# EasyEDA Pro project ProPrj_电容计量V2_2026-06-24.epro, schematic Schematic18
Board Name: Board2; Create Date: 2026-04-20; Page Name: P1; Project Name: 电容计量V2; Schematic Name: Schematic18; Update Date: 2026-04-20; Page Size: A4; Version: V1.0
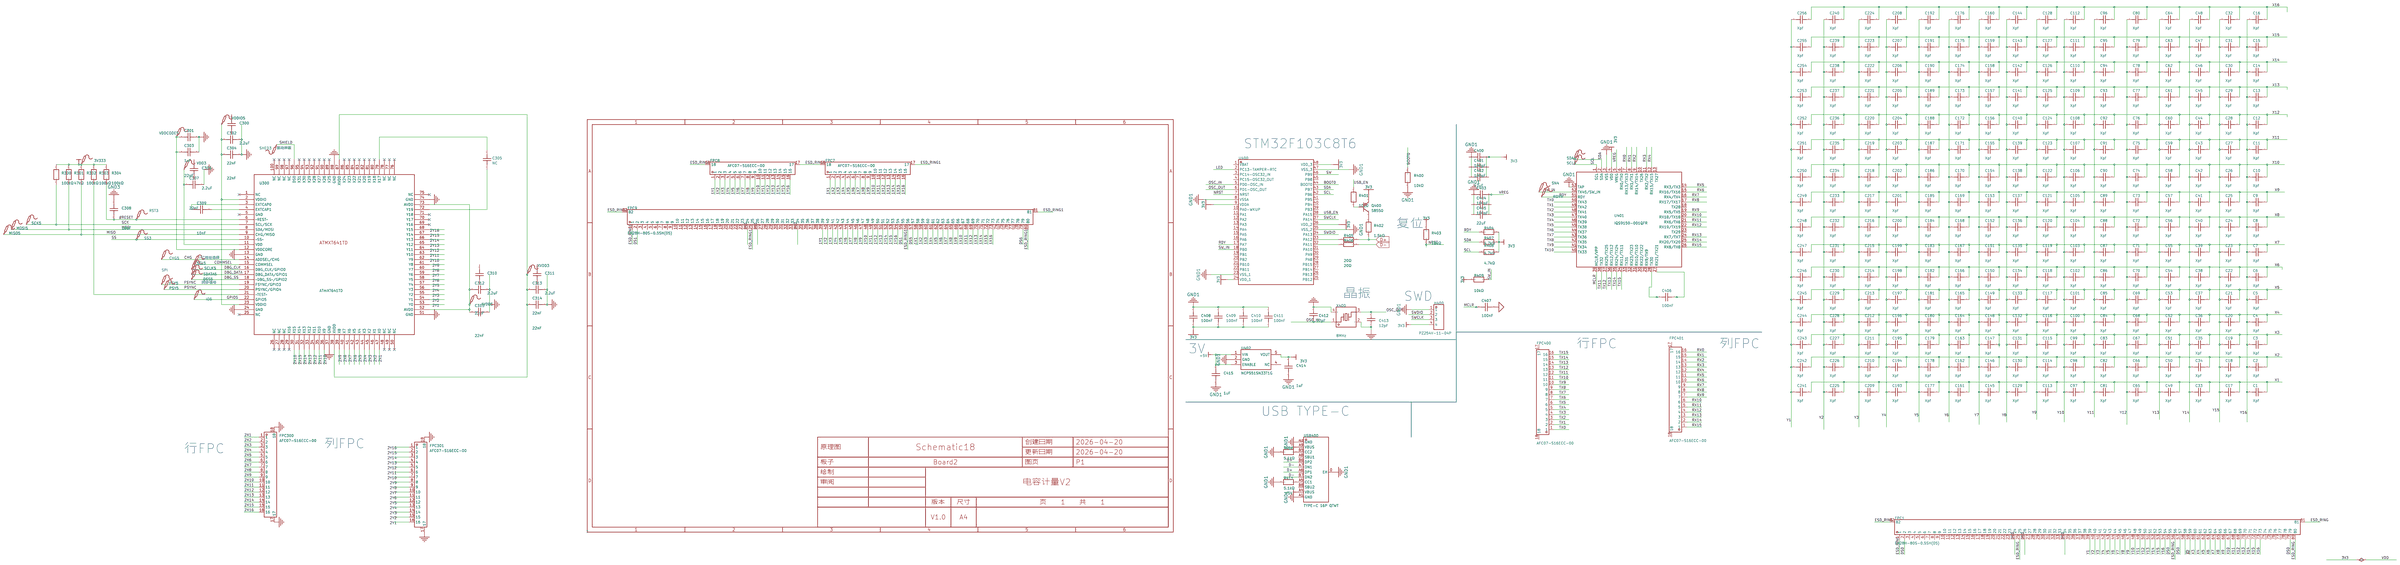
[diagram p1: schematic sheet]

## Parts
3V333  -  [Test-Point-0.5mm]
AVDD5  -  [Test-Point-0.5mm]
C1  Xpf  [CAP_C_0603]
C2  Xpf  [CAP_C_0603]
C3  Xpf  [CAP_C_0603]
C4  Xpf  [CAP_C_0603]
C5  Xpf  [CAP_C_0603]
C6  Xpf  [CAP_C_0603]
C7  Xpf  [CAP_C_0603]
C8  Xpf  [CAP_C_0603]
C9  Xpf  [CAP_C_0603]
C10  Xpf  [CAP_C_0603]
C11  Xpf  [CAP_C_0603]
C12  Xpf  [CAP_C_0603]
C13  Xpf  [CAP_C_0603]
C14  Xpf  [CAP_C_0603]
C15  Xpf  [CAP_C_0603]
C16  Xpf  [CAP_C_0603]
C17  Xpf  [CAP_C_0603]
C18  Xpf  [CAP_C_0603]
C19  Xpf  [CAP_C_0603]
C20  Xpf  [CAP_C_0603]
C21  Xpf  [CAP_C_0603]
C22  Xpf  [CAP_C_0603]
C23  Xpf  [CAP_C_0603]
C24  Xpf  [CAP_C_0603]
C25  Xpf  [CAP_C_0603]
C26  Xpf  [CAP_C_0603]
C27  Xpf  [CAP_C_0603]
C28  Xpf  [CAP_C_0603]
C29  Xpf  [CAP_C_0603]
C30  Xpf  [CAP_C_0603]
C31  Xpf  [CAP_C_0603]
C32  Xpf  [CAP_C_0603]
C33  Xpf  [CAP_C_0603]
C34  Xpf  [CAP_C_0603]
C35  Xpf  [CAP_C_0603]
C36  Xpf  [CAP_C_0603]
C37  Xpf  [CAP_C_0603]
C38  Xpf  [CAP_C_0603]
C39  Xpf  [CAP_C_0603]
C40  Xpf  [CAP_C_0603]
C41  Xpf  [CAP_C_0603]
C42  Xpf  [CAP_C_0603]
C43  Xpf  [CAP_C_0603]
C44  Xpf  [CAP_C_0603]
C45  Xpf  [CAP_C_0603]
C46  Xpf  [CAP_C_0603]
C47  Xpf  [CAP_C_0603]
C48  Xpf  [CAP_C_0603]
C49  Xpf  [CAP_C_0603]
C50  Xpf  [CAP_C_0603]
C51  Xpf  [CAP_C_0603]
C52  Xpf  [CAP_C_0603]
C53  Xpf  [CAP_C_0603]
C54  Xpf  [CAP_C_0603]
C55  Xpf  [CAP_C_0603]
C56  Xpf  [CAP_C_0603]
C57  Xpf  [CAP_C_0603]
C58  Xpf  [CAP_C_0603]
C59  Xpf  [CAP_C_0603]
C60  Xpf  [CAP_C_0603]
C61  Xpf  [CAP_C_0603]
C62  Xpf  [CAP_C_0603]
C63  Xpf  [CAP_C_0603]
C64  Xpf  [CAP_C_0603]
C65  Xpf  [CAP_C_0603]
C66  Xpf  [CAP_C_0603]
C67  Xpf  [CAP_C_0603]
C68  Xpf  [CAP_C_0603]
C69  Xpf  [CAP_C_0603]
C70  Xpf  [CAP_C_0603]
C71  Xpf  [CAP_C_0603]
C72  Xpf  [CAP_C_0603]
C73  Xpf  [CAP_C_0603]
C74  Xpf  [CAP_C_0603]
C75  Xpf  [CAP_C_0603]
C76  Xpf  [CAP_C_0603]
C77  Xpf  [CAP_C_0603]
C78  Xpf  [CAP_C_0603]
C79  Xpf  [CAP_C_0603]
C80  Xpf  [CAP_C_0603]
C81  Xpf  [CAP_C_0603]
C82  Xpf  [CAP_C_0603]
C83  Xpf  [CAP_C_0603]
C84  Xpf  [CAP_C_0603]
C85  Xpf  [CAP_C_0603]
C86  Xpf  [CAP_C_0603]
C87  Xpf  [CAP_C_0603]
C88  Xpf  [CAP_C_0603]
C89  Xpf  [CAP_C_0603]
C90  Xpf  [CAP_C_0603]
C91  Xpf  [CAP_C_0603]
C92  Xpf  [CAP_C_0603]
C93  Xpf  [CAP_C_0603]
C94  Xpf  [CAP_C_0603]
C95  Xpf  [CAP_C_0603]
C96  Xpf  [CAP_C_0603]
C97  Xpf  [CAP_C_0603]
C98  Xpf  [CAP_C_0603]
C99  Xpf  [CAP_C_0603]
C100  Xpf  [CAP_C_0603]
C101  Xpf  [CAP_C_0603]
C102  Xpf  [CAP_C_0603]
C103  Xpf  [CAP_C_0603]
C104  Xpf  [CAP_C_0603]
C105  Xpf  [CAP_C_0603]
C106  Xpf  [CAP_C_0603]
C107  Xpf  [CAP_C_0603]
C108  Xpf  [CAP_C_0603]
C109  Xpf  [CAP_C_0603]
C110  Xpf  [CAP_C_0603]
C111  Xpf  [CAP_C_0603]
C112  Xpf  [CAP_C_0603]
C113  Xpf  [CAP_C_0603]
C114  Xpf  [CAP_C_0603]
C115  Xpf  [CAP_C_0603]
C116  Xpf  [CAP_C_0603]
C117  Xpf  [CAP_C_0603]
C118  Xpf  [CAP_C_0603]
C119  Xpf  [CAP_C_0603]
C120  Xpf  [CAP_C_0603]
C121  Xpf  [CAP_C_0603]
C122  Xpf  [CAP_C_0603]
C123  Xpf  [CAP_C_0603]
C124  Xpf  [CAP_C_0603]
C125  Xpf  [CAP_C_0603]
C126  Xpf  [CAP_C_0603]
C127  Xpf  [CAP_C_0603]
C128  Xpf  [CAP_C_0603]
C129  Xpf  [CAP_C_0603]
C130  Xpf  [CAP_C_0603]
C131  Xpf  [CAP_C_0603]
C132  Xpf  [CAP_C_0603]
C133  Xpf  [CAP_C_0603]
C134  Xpf  [CAP_C_0603]
C135  Xpf  [CAP_C_0603]
C136  Xpf  [CAP_C_0603]
C137  Xpf  [CAP_C_0603]
C138  Xpf  [CAP_C_0603]
C139  Xpf  [CAP_C_0603]
C140  Xpf  [CAP_C_0603]
C141  Xpf  [CAP_C_0603]
C142  Xpf  [CAP_C_0603]
C143  Xpf  [CAP_C_0603]
C144  Xpf  [CAP_C_0603]
C145  Xpf  [CAP_C_0603]
C146  Xpf  [CAP_C_0603]
C147  Xpf  [CAP_C_0603]
C148  Xpf  [CAP_C_0603]
C149  Xpf  [CAP_C_0603]
C150  Xpf  [CAP_C_0603]
C151  Xpf  [CAP_C_0603]
C152  Xpf  [CAP_C_0603]
C153  Xpf  [CAP_C_0603]
C154  Xpf  [CAP_C_0603]
C155  Xpf  [CAP_C_0603]
C156  Xpf  [CAP_C_0603]
C157  Xpf  [CAP_C_0603]
C158  Xpf  [CAP_C_0603]
C159  Xpf  [CAP_C_0603]
C160  Xpf  [CAP_C_0603]
C161  Xpf  [CAP_C_0603]
C162  Xpf  [CAP_C_0603]
C163  Xpf  [CAP_C_0603]
C164  Xpf  [CAP_C_0603]
C165  Xpf  [CAP_C_0603]
C166  Xpf  [CAP_C_0603]
C167  Xpf  [CAP_C_0603]
C168  Xpf  [CAP_C_0603]
C169  Xpf  [CAP_C_0603]
C170  Xpf  [CAP_C_0603]
C171  Xpf  [CAP_C_0603]
C172  Xpf  [CAP_C_0603]
C173  Xpf  [CAP_C_0603]
C174  Xpf  [CAP_C_0603]
C175  Xpf  [CAP_C_0603]
C176  Xpf  [CAP_C_0603]
C177  Xpf  [CAP_C_0603]
C178  Xpf  [CAP_C_0603]
C179  Xpf  [CAP_C_0603]
C180  Xpf  [CAP_C_0603]
C181  Xpf  [CAP_C_0603]
C182  Xpf  [CAP_C_0603]
C183  Xpf  [CAP_C_0603]
C184  Xpf  [CAP_C_0603]
C185  Xpf  [CAP_C_0603]
C186  Xpf  [CAP_C_0603]
C187  Xpf  [CAP_C_0603]
C188  Xpf  [CAP_C_0603]
C189  Xpf  [CAP_C_0603]
C190  Xpf  [CAP_C_0603]
C191  Xpf  [CAP_C_0603]
C192  Xpf  [CAP_C_0603]
C193  Xpf  [CAP_C_0603]
C194  Xpf  [CAP_C_0603]
C195  Xpf  [CAP_C_0603]
C196  Xpf  [CAP_C_0603]
C197  Xpf  [CAP_C_0603]
C198  Xpf  [CAP_C_0603]
C199  Xpf  [CAP_C_0603]
C200  Xpf  [CAP_C_0603]
C201  Xpf  [CAP_C_0603]
C202  Xpf  [CAP_C_0603]
C203  Xpf  [CAP_C_0603]
C204  Xpf  [CAP_C_0603]
C205  Xpf  [CAP_C_0603]
C206  Xpf  [CAP_C_0603]
C207  Xpf  [CAP_C_0603]
C208  Xpf  [CAP_C_0603]
C209  Xpf  [CAP_C_0603]
C210  Xpf  [CAP_C_0603]
C211  Xpf  [CAP_C_0603]
C212  Xpf  [CAP_C_0603]
C213  Xpf  [CAP_C_0603]
C214  Xpf  [CAP_C_0603]
C215  Xpf  [CAP_C_0603]
C216  Xpf  [CAP_C_0603]
C217  Xpf  [CAP_C_0603]
C218  Xpf  [CAP_C_0603]
C219  Xpf  [CAP_C_0603]
C220  Xpf  [CAP_C_0603]
C221  Xpf  [CAP_C_0603]
C222  Xpf  [CAP_C_0603]
C223  Xpf  [CAP_C_0603]
C224  Xpf  [CAP_C_0603]
C225  Xpf  [CAP_C_0603]
C226  Xpf  [CAP_C_0603]
C227  Xpf  [CAP_C_0603]
C228  Xpf  [CAP_C_0603]
C229  Xpf  [CAP_C_0603]
C230  Xpf  [CAP_C_0603]
C231  Xpf  [CAP_C_0603]
C232  Xpf  [CAP_C_0603]
C233  Xpf  [CAP_C_0603]
C234  Xpf  [CAP_C_0603]
C235  Xpf  [CAP_C_0603]
C236  Xpf  [CAP_C_0603]
C237  Xpf  [CAP_C_0603]
C238  Xpf  [CAP_C_0603]
C239  Xpf  [CAP_C_0603]
C240  Xpf  [CAP_C_0603]
C241  Xpf  [CAP_C_0603]
C242  Xpf  [CAP_C_0603]
C243  Xpf  [CAP_C_0603]
C244  Xpf  [CAP_C_0603]
C245  Xpf  [CAP_C_0603]
C246  Xpf  [CAP_C_0603]
C247  Xpf  [CAP_C_0603]
C248  Xpf  [CAP_C_0603]
C249  Xpf  [CAP_C_0603]
C250  Xpf  [CAP_C_0603]
C251  Xpf  [CAP_C_0603]
C252  Xpf  [CAP_C_0603]
C253  Xpf  [CAP_C_0603]
C254  Xpf  [CAP_C_0603]
C255  Xpf  [CAP_C_0603]
C256  Xpf  [CAP_C_0603]
C300  2.2uF  [C0402]
C301  1uF  [C0402]
C302  22nF  [C0402]
C303  22nF  [C0402]
C304  22nF  [C0402]
C305  NC  [C0402]
C306  2.2uF  [C0402]
C307  22nF  [C0402]
C308  10nF  [C0402]
C309  10nF  [C0402]
C310  2.2uF  [C0402]
C311  2.2uF  [C0402]
C312  22nF  [C0402]
C313  22nF  [C0402]
C314  22nF  [C0402]
C315  22nF  [C0402]
C400  100pF  [C0402]
C401  100nF  [C0402]
C402  47uF  [C0603]
C403  100pF  [C0402]
C404  100nF  [C0402]
C405  22uF  [C0402]
C406  100nF  [C0402]
C407  100nF  [C0402]
C408  100nF  [C0402]
C409  100nF  [C0402]
C410  100nF  [C0402]
C411  100nF  [C0402]
C412  12pF  [C0402]
C413  12pF  [C0402]
C414  1uF  [C0402]
C415  1uF  [C0402]
CHG5  -  [Test-Point-0.5mm]
DSS5  -  [Test-Point-0.5mm]
FPC1  FH28H-80S-0.5SH(05)  [FFC-SMD_80P-P0.50_FH28H-80S-0.5SH]
FPC7  AFC07-S16ECC-00  [FPC-SMD_16P-P0.50_AFC07-S16ECC-00]
FPC8  AFC07-S16ECC-00  [FPC-SMD_16P-P0.50_AFC07-S16ECC-00]
FPC9  FH28H-80S-0.5SH(05)  [FFC-SMD_80P-P0.50_FH28H-80S-0.5SH]
FPC300  AFC07-S16ECC-00  [FPC-SMD_16P-P0.50_AFC07-S16ECC-00]
FPC301  AFC07-S16ECC-00  [FPC-SMD_16P-P0.50_AFC07-S16ECC-00]
FPC400  AFC07-S16ECC-00  [FPC-SMD_16P-P0.50_AFC07-S16ECC-00]
FPC401  AFC07-S16ECC-00  [FPC-SMD_16P-P0.50_AFC07-S16ECC-00]
FSY5  -  [Test-Point-0.5mm]
H400  PZ254V-11-04P  [HDR-TH_4P-P2.54-V-M]
IO5  -  [Test-Point-0.5mm]
MISO5  -  [Test-Point-0.5mm]
MOSI5  -  [Test-Point-0.5mm]
PSY5  -  [Test-Point-0.5mm]
Q400  S8550  [SOT-23-3_L2.9-W1.3-P1.90-LS2.4-BR]
R300  100kΩ  [R0402]
R301  47kΩ  [R0402]
R302  100kΩ  [R0402]
R303  100kΩ  [R0402]
R304  100kΩ  [R0402]
R400  10kΩ  [R0402]
R401  10kΩ  [R0402]
R402  1.5kΩ  [R0402]
R403  10kΩ  [R0402]
R404  4.7kΩ  [R0402]
R405  20Ω  [R0402]
R406  20Ω  [R0402]
R407  4.7kΩ  [R0402]
R408  4.7kΩ  [R0402]
R409  10kΩ  [R0402]
R410  5.1kΩ  [R0402]
R411  5.1kΩ  [R0402]
RDY4  -  [Test-Point-0.5mm]
RST3  -  [Test-Point-0.5mm]
SCK5  -  [Test-Point-0.5mm]
SCL4  -  [Test-Point-0.5mm]
SCLK5  -  [Test-Point-0.5mm]
SDA4  -  [Test-Point-0.5mm]
SDATA5  -  [Test-Point-0.5mm]
SEL5  -  [Test-Point-0.5mm]
SHED3  -  [Test-Point-0.5mm]
SN4  -  [Test-Point-0.5mm]
SS3  -  [Test-Point-0.5mm]
U300  ATmXT641TD  [ATMXT641TD]
U400  -  [LQFP-48_L7.0-W7.0-P0.50-LS9.0-BL]
U401  IQS9150-001QFR  [QFN1-52_L6.0-W6.0-P0.40-TL-EP4.5]
U402  NCP551SN33T1G  [SOT-23-5_L3.0-W1.7-P0.95-LS2.8-BR]
USB400  TYPE-C 16P QTWT  [USB-TYPE-C-SMD_TYPE-C-16P-QTWT]
VDD3  -  [Test-Point-0.5mm]
VDDCODE5  -  [Test-Point-0.5mm]
VDDIO5  -  [Test-Point-0.5mm]
X400  8MHz  [CRYSTAL-SMD_4P-L3.2-W2.5-BL-1]
XVDD3  -  [Test-Point-0.5mm]

## Library data of the parts
3V333 AVDD5 CHG5 DSS5 FSY5 IO5 MISO5 MOSI5 PSY5 RDY4 RST3 SCK5 SCL4 SCLK5 SDA4 SDATA5 SEL5 SHED3 SN4 SS3 VDD3 VDDCODE5 VDDIO5 XVDD3 = Test-Point: Test Point 测试点; Check: false
C1 = C1608X6S1C225KTJ00E: Supplier Part: C342995; Manufacturer: TDK; Manufacturer Part: 12; Supplier Footprint: 0603; Datasheet: https://item.szlcsc.com/datasheet/C1608X6S1C225KTJ00E/319845.html; Supplier: LCSC; Check: false
C2-C256 = C1608X6S1C225KTJ00E: Supplier Part: C342995; Manufacturer: TDK; Supplier Footprint: 0603; Datasheet: https://item.szlcsc.com/datasheet/C1608X6S1C225KTJ00E/319845.html; Supplier: LCSC; Check: false
C300 C306 C310 C311 = TCC0402X5R225M6R3AT: 容值:2.2uF;精度:±20%;额定电压:6.3V;温度系数:X5R;; LCSC Part Name: 2.2uF ±20% 6.3V; Supplier Part: C380298; Manufacturer: CCTC(三环); Supplier Footprint: 0402; JLCPCB Part Class: Extended Part; Datasheet: https://item.szlcsc.com/datasheet/TCC0402X5R225M6R3AT/352703.html; Supplier: LCSC; Tolerance: ±20%; Voltage Rating: 6.3V; Temperature Coefficient: X5R
C301 C414 C415 = FCC0402X105K6R3AT: 容值:1uF;精度:±10%;额定电压:6.3V;温度系数:X5R;; LCSC Part Name: 1uF ±10% 6.3V; Supplier Part: C5137474; Manufacturer: FOJAN(富捷); Supplier Footprint: 0402; JLCPCB Part Class: Extended Part; Datasheet: https://item.szlcsc.com/datasheet/FCC0402X105K6R3AT/5746976.html; Supplier: LCSC; Tolerance: ±10%; Voltage Rating: 6.3V; Temperature Coefficient: X5R
C302-C304 C307 C312-C315 = TCC0402X7R223M500AT: 容值:22nF;精度:±20%;额定电压:50V;温度系数:X7R;; LCSC Part Name: 22nF ±20% 50V; Supplier Part: C6266887; Manufacturer: CCTC(三环); Supplier Footprint: 0402; JLCPCB Part Class: Extended Part; Datasheet: https://item.szlcsc.com/datasheet/TCC0402X7R223M500AT/7212752.html; Supplier: LCSC; Tolerance: ±20%; Voltage Rating: 50V; Temperature Coefficient: X7R
C305 = CC0402KRX7R7BB104: 容值:100nF;精度:±10%;额定电压:16V;温度系数:X7R;; LCSC Part Name: 100nF ±10% 16V; Supplier Part: C60474; Manufacturer: YAGEO(国巨); Supplier Footprint: 0402; JLCPCB Part Class: Extended Part; Datasheet: https://atta.szlcsc.com/upload/public/pdf/source/20211223/9278FD768280B81DDBEF48FA36411A03.pdf; Supplier: LCSC; Tolerance: ±10%; Voltage Rated: 16V; Temperature Coefficient: X7R; Check: false
C308 C309 = TCC0402X7R103M500AT: 容值:10nF;精度:±20%;额定电压:50V;温度系数:X7R;; LCSC Part Name: 10nF ±20% 50V; Supplier Part: C696856; Manufacturer: CCTC(三环); Supplier Footprint: 0402; JLCPCB Part Class: Extended Part; Datasheet: https://item.szlcsc.com/datasheet/TCC0402X7R103M500AT/730940.html; Supplier: LCSC; Tolerance: ±20%; Voltage Rating: 50V; Temperature Coefficient: X7R
C400 C403 = TCC0402X7R101K500AT: 容值:100pF;精度:±10%;额定电压:50V;温度系数:X7R;; LCSC Part Name: 100pF ±10% 50V; Supplier Part: C5142577; Manufacturer: CCTC(三环); Supplier Footprint: 0402; JLCPCB Part Class: Extended Part; Datasheet: https://item.szlcsc.com/datasheet/TCC0402X7R101K500AT/5758979.html; Supplier: LCSC; Tolerance: ±10%; Voltage Rating: 50V; Temperature Coefficient: X7R
C401 C404 C406 C407 = FCC0402B104K160AT: 容值:100nF;精度:±10%;额定电压:16V;温度系数:X7R;; LCSC Part Name: 100nF ±10% 16V; Supplier Part: C5137468; Manufacturer: FOJAN(富捷); Supplier Footprint: 0402; JLCPCB Part Class: Extended Part; Datasheet: https://item.szlcsc.com/datasheet/FCC0402B104K160AT/5746970.html; Supplier: LCSC; Tolerance: ±10%; Voltage Rating: 16V; Temperature Coefficient: X7R
C402 = CL10A476MQ8QRNC: 容值:47uF;精度:±20%;额定电压:6.3V;温度系数:X5R;; LCSC Part Name: 47uF ±20% 6.3V; Supplier Part: C730416; Manufacturer: SAMSUNG(三星); Supplier Footprint: 0603; JLCPCB Part Class: Extended Part; Datasheet: https://item.szlcsc.com/datasheet/CL10A476MQ8QRNC/778815.html; Supplier: LCSC; Tolerance: ±20%; Voltage Rating: 6.3V; Temperature Coefficient: X5R
C405 = GRM155R60J226ME11D: 容值:22uF;精度:±20%;额定电压:6.3V;温度系数:X5R;; LCSC Part Name: 22uF ±20% 6.3V; Supplier Part: C415703; Manufacturer: muRata(村田); Supplier Footprint: 0402; JLCPCB Part Class: Extended Part; Datasheet: https://item.szlcsc.com/datasheet/GRM155R60J226ME11D/408393.html; Supplier: LCSC; Tolerance: ±20%; Voltage Rating: 6.3V; Temperature Coefficient: X5R
C408-C411 = CC0402KRX7R7BB104: 容值:100nF;精度:±10%;额定电压:16V;温度系数:X7R;; LCSC Part Name: 100nF ±10% 16V; Supplier Part: C60474; Manufacturer: YAGEO(国巨); Supplier Footprint: 0402; JLCPCB Part Class: Extended Part; Datasheet: https://atta.szlcsc.com/upload/public/pdf/source/20211223/9278FD768280B81DDBEF48FA36411A03.pdf; Supplier: LCSC; Tolerance: ±10%; Voltage Rated: 16V; Temperature Coefficient: X7R
C412 C413 = GCM1555C1H120FA16D: 容值:12pF;精度:±1%;额定电压:50V;材质(温度系数):C0G;; LCSC Part Name: 12pF ±1% 50V; Supplier Part: C393682; Manufacturer: muRata(村田); Supplier Footprint: 0402; JLCPCB Part Class: Extended Part; Datasheet: https://atta.szlcsc.com/upload/public/pdf/source/20190516/C393682_2405B7553F1D74F0F214F12B2CF6E34B.pdf; Supplier: LCSC; Tolerance: ±1%; Voltage Rated: 50V; Temperature Coefficient: C0G
FPC1 FPC9 = FH28H-80S-0.5SH(05): 锁定特性:-;触点类型:下接;触点数量:80P;间距:0.5mm;安装类型:卧贴;工作温度范围:-40℃~+105℃;; LCSC Part Name: 间距:0.5mm P数:80P 下接; Supplier Part: C424679; Manufacturer: HRS(广濑); Supplier Footprint: SMD,P=0.5mm,卧贴; JLCPCB Part Class: Extended Part; Datasheet: https://atta.szlcsc.com/upload/public/pdf/source/20190903/C424679_77A87A094313EE4221719E31E2589B07.pdf; Supplier: LCSC; Contact Type: 下接; Number of Contacts: 80P; Pitch: 0.5mm; Mounting Type: 卧贴; FFC, FCB Thickness: 0.3mm; Height Above Board: 2.54mm; Contact Material: 磷青铜; Contact Plating: 金; Operating Temperature Range: -40℃~+105℃
FPC7 FPC8 FPC300 FPC301 FPC400 FPC401 = AFC07-S16ECC-00: 锁定特性:抽屉式;触点类型:上接;触点数量:16P;间距:0.5mm;安装方式:卧贴;工作温度:-25℃~+85℃;; LCSC Part Name: 抽屉式 上接 P数:16P 间距:0.5mm; Supplier Part: C11088; Manufacturer: JS(钜硕电子); Supplier Footprint: SMD,P=0.5mm,卧贴; JLCPCB Part Class: Extended Part; Datasheet: https://item.szlcsc.com/datasheet/AFC07-S16ECC-00/11635.html; Supplier: LCSC; Locking Feature: 抽屉式; Contact Type: 上接; Number of Contacts: 16P; Pitch: 0.5mm; Mounting Type: 卧贴; FFC, FCB Thickness: 0.3mm; Height Above Board: 2mm; Contact Material: 磷青铜; Contact Plating: 锡; Operating Temperature: -25℃~+85℃; Rated Voltage (Max): 50V; Current Rating (Max): 400mA
H400 = PZ254V-11-04P: 插针结构:1x4P;间距:2.54mm;行距:-;圆针/方针:方针;安装方式:直插;排数:单排;总PIN位数:4P;额定电流:3A;额定电压:250V;配合针长度:6mm;塑高:2.5mm;端接针长度:3mm;触头材质:-;工作温度:-40℃~+105℃;颜色:黑色;; LCSC Part Name: 1x4P 间距:2.54mm 方针 直插; Supplier Part: C2691448; Manufacturer: XFCN(兴飞); Supplier Footprint: 插件,P=2.54mm; JLCPCB Part Class: 扩展库; Datasheet: https://item.szlcsc.com/datasheet/PZ254V-11-04P/2801085.html; Supplier: LCSC; Pin Structure: 1x4P; Pitch: 2.54mm; Circluar Pins/Square Pins: 方针; Mounting Type: 直插; Number of Rows: 单排; Number of Pins: 4P; Current Rating: 3A; Voltage Rating (Max): 250V; Length of Mating Pin: 6mm; Insulation Height: 2.5mm; Length of End Connection Pin: 3mm; Operating Temperature: -40℃~+105℃; Color: 黑色
Q400 = S8550: LCSC Part Name: PNP -25V -500mA 120-400 SOT-23; Supplier Part: C2931720; Manufacturer: Doeshare(德芯); Supplier Footprint: SOT-23; JLCPCB Part Class: 扩展库; Datasheet: https://atta.szlcsc.com/upload/public/pdf/source/20220104/15A23F6542E365B9E2BA018BE45092B6.pdf; Supplier: LCSC
R300 R302-R304 = FRC0402J104 TS: 电阻类型:厚膜电阻;阻值:100kΩ;精度:±5%;功率:62.5mW;工作电压:50V;温度系数:±100ppm/℃;; LCSC Part Name: 100kΩ ±5% 62.5mW 厚膜电阻; Supplier Part: C2906883; Manufacturer: FOJAN(富捷); Supplier Footprint: 0402; JLCPCB Part Class: Extended Part; Supplier: LCSC; Type: 厚膜电阻; Tolerance: ±5%; Power(Watts): 62.5mW; Voltage-Supply(Max): 50V; Temperature Coefficient: ±100ppm/℃; Operating Temperature: -55℃~+155℃
R301 = SC0402J4702F2ANRH: 电阻类型:厚膜电阻;阻值:47kΩ;精度:±5%;功率:62.5mW;工作电压:50V;温度系数:±100ppm/℃;; LCSC Part Name: 厚膜电阻 47kΩ ±5% 62.5mW; Supplier Part: C3152115; Manufacturer: Sunway(信维通信); Supplier Footprint: 0402; JLCPCB Part Class: Extended Part; Datasheet: https://item.szlcsc.com/datasheet/SC0402J4702F2ANRH/3713914.html; Supplier: LCSC; Type: 厚膜电阻; Tolerance: ±5%; Power(Watts): 62.5mW; Voltage-Supply(Max): 50V; Temperature Coefficient: ±100ppm/℃; Operating Temperature: -55℃~+155℃
R400 R401 R403 R409 = SCR0402J10K: 电阻类型:厚膜电阻;阻值:10kΩ;精度:±5%;功率:62.5mW;工作电压:50V;; LCSC Part Name: 厚膜电阻 10kΩ ±5% 62.5mW; Supplier Part: C3017497; Manufacturer: VO(翔胜); Supplier Footprint: 0402; JLCPCB Part Class: Extended Part; Datasheet: https://item.szlcsc.com/datasheet/SCR0402J10K/3530021.html; Supplier: LCSC; Type: 厚膜电阻; Tolerance: ±5%; Power(Watts): 62.5mW; Voltage-Supply(Max): 50V; Operating Temperature: -55℃~+155℃
R402 = RCA021K5JLF: 电阻类型:厚膜电阻;阻值:1.5kΩ;精度:±5%;功率:62.5mW;工作电压:50V;温度系数:±200ppm/℃;; LCSC Part Name: 1.5kΩ ±5% 62.5mW; Supplier Part: C22369162; Manufacturer: HKR(香港电阻); Supplier Footprint: 0402; JLCPCB Part Class: Extended Part; Datasheet: https://item.szlcsc.com/datasheet/RCA021K5JLF/23848192.html; Supplier: LCSC; Type: 厚膜电阻; Tolerance: ±5%; Power(Watts): 62.5mW; Voltage-Supply(Max): 50V; Temperature Coefficient: ±200ppm/℃; Operating Temperature: -55℃~+155℃
R404 R407 R408 = SCR0402J4K7: 电阻类型:厚膜电阻;阻值:4.7kΩ;精度:±5%;功率:62.5mW;工作电压:50V;; LCSC Part Name: 厚膜电阻 4.7kΩ ±5% 62.5mW; Supplier Part: C3017492; Manufacturer: VO(翔胜); Supplier Footprint: 0402; JLCPCB Part Class: Extended Part; Datasheet: https://item.szlcsc.com/datasheet/SCR0402J4K7/3530016.html; Supplier: LCSC; Type: 厚膜电阻; Tolerance: ±5%; Power(Watts): 62.5mW; Voltage-Supply(Max): 50V; Operating Temperature: -55℃~+155℃
R405 R406 = RC-02W200JT: 电阻类型:厚膜电阻;阻值:20Ω;精度:±5%;功率:62.5mW;工作电压:50V;温度系数:±200ppm/℃;; LCSC Part Name: 厚膜电阻 20Ω ±5% 62.5mW 停产; Supplier Part: C310255; Manufacturer: FH(风华); Supplier Footprint: 0402; JLCPCB Part Class: Extended Part; Datasheet: https://item.szlcsc.com/datasheet/RC-02W200JT/293745.html; Supplier: LCSC; Type: 厚膜电阻; Tolerance: ±5%; Power(Watts): 62.5mW; Voltage-Supply(Max): 50V; Temperature Coefficient: ±200ppm/℃; Operating Temperature: -55℃~+155℃
R410 R411 = SC0402J5101F2ANRH: 电阻类型:厚膜电阻;阻值:5.1kΩ;精度:±5%;功率:62.5mW;工作电压:50V;温度系数:±100ppm/℃;; LCSC Part Name: 厚膜电阻 5.1kΩ ±5% 62.5mW; Supplier Part: C5356293; Manufacturer: Sunway(信维通信); Supplier Footprint: 0402; JLCPCB Part Class: Extended Part; Datasheet: https://item.szlcsc.com/datasheet/SC0402J5101F2ANRH/6159977.html; Supplier: LCSC; Type: 厚膜电阻; Tolerance: ±5%; Power(Watts): 62.5mW; Voltage-Supply(Max): 50V; Temperature Coefficient: ±100ppm/℃; Operating Temperature: -55℃~+155℃
U300 = ATmXT641TD: Check: false
U400 = STM32F103C8T6: 工作电压:2V ~ 3.6V;CPU位数:32-Bit;CPU内核:ARM- Cortex--M3;主频（MAX):72MHz;ROM类型:FLASH;; Supplier Part: C8734; Manufacturer: ST(意法半导体); Supplier Footprint: LQFP-48_7x7x05P; JLCPCB Part Class: Basic Part; Datasheet: https://atta.szlcsc.com/upload/public/pdf/source/20140724/1457707174202.pdf; Supplier: LCSC
U401 = IQS9150-001QFR: Supplier Part: C42000478; JLCPCB Part Class: Extended Part; Supplier: LCSC; Check: false
U402 = NCP551SN33T1G: 输出类型:固定;最大输入电压:12V;输出电压:3.3V;最大输出电流:150mA;电源纹波抑制比(PSRR):-;输出极性:正极;; LCSC Part Name: 输入12V 输出3.3V 150mA; Supplier Part: C58434; Manufacturer: onsemi(安森美); Supplier Footprint: TSOP-5; JLCPCB Part Class: 扩展库; Datasheet: https://atta.szlcsc.com/upload/public/pdf/source/20150917/1457707389016.pdf; Supplier: LCSC; Output Type: 固定; Maximum Input Voltage: 12V; Output Voltage: 3.3V; MAX Output Current: 150mA; Dropout Voltage: 150mV@(10mA); standby current: 8uA; Operating Temperature: -40℃~+85℃; Output Polarity: 正极; Number of Outputs: 1
USB400 = TYPE-C 16P QTWT: 连接器类型:Type-C;协议标准:USB 3.1;公母:母;安装方式:卧贴;触点数量:16P;端口数量:1;额定电流 - 电源:3A;工作温度:-25℃~+85℃;; LCSC Part Name: Type-C 母 卧贴; Supplier Part: C5187472; Manufacturer: SHOU HAN(首韩); Supplier Footprint: SMD; JLCPCB Part Class: Extended Part; Datasheet: https://item.szlcsc.com/datasheet/TYPE-C%252016P%2520QTWT/5860367.html; Supplier: LCSC; Connector Type: Type-C; Protocol Standard: USB 3.1; Gender: 母; Mounting Type: 卧贴; Number of Contacts: 16P; Number of Ports: 1; Current Rating-Power: 3A; Voltage Rating: 5V; Connect-Disconnect Life: 5千次; Detection color: 黑色; Operating Temperature: -25℃~+85℃
X400 = XL2EL89COI-111YLC-8M: 晶振类型:贴片晶振;频率:8MHz;常温频差:±10ppm;外接负载电容:12pF;频率稳定度(全温):±20ppm;; LCSC Part Name: 8MHz ±10ppm 12pF; Supplier Part: C2973805; Manufacturer: YXC(扬兴晶振); Supplier Footprint: SMD3225-4P; JLCPCB Part Class: 扩展库; Datasheet: https://atta.szlcsc.com/upload/public/pdf/source/20240329/19D5F850207469550BEB00D7DFEDBC7A.pdf; Supplier: LCSC; Crystal Type: 贴片晶振; Normal temperature Frequency Tolerance: ±10ppm; External load capacitor: 12pF; Frequency Stability(Full temperature range): ±20ppm; Equivalent Series Resistance (ESR): 150Ω; Operating Temperature: -40℃~+85℃

## Nets
3V3: C400.1 C408.1 C409.1 C410.1 C411.1 C414.2 H400.4 Q400.2(E) R403.2 R404.1 R407.1 R408.1 R409.2 U400.9(VDDA) U400.24(VDD_1) U400.36(VDD_2) U400.48(VDD_3) U401.4(VDD) U402.5(VOUT)
3V33: 3V333.1 R300.2 R301.2 R302.2 R303.2 R304.2
+5V: C415.2 U402.1(VIN) U402.3(ENABLE) USB400.A4(VBUS) USB400.A9(VBUS)
GND1: C408.2 C409.2 C410.2 C411.2 C412.2 C413.1 C414.1 C415.1 H400.1 R400.1 R410.2 R411.2 U400.8(VSSA) U400.23(VSS_1) U400.35(VSS_2) U400.47(VSS_3) U401.3(VSS) U401.53(TAP) U402.2(GND) USB400.0(EH) USB400.A1(GND) USB400.A12(GND) X400.2(GND) X400.4(GND)
GND3: C301.1 C302.1 C303.1 C304.1 C307.1 C308.1 C312.1 C313.1 C314.1 C315.1 FPC300.17 FPC300.18 FPC301.17 FPC301.18 U300.13(GND) U300.24(GND) U300.37(GND) U300.51(GND) U300.74(GND) U300.88(GND)
1X1: FPC7.1 FPC9.58
1X2: FPC7.2 FPC9.59
1X3: FPC7.3 FPC9.60
1X4: FPC7.4 FPC9.61
1X5: FPC7.5 FPC9.62
1X6: FPC7.6 FPC9.63
1X7: FPC7.7 FPC9.64
1X8: FPC7.8 FPC9.65
1X9: FPC7.9 FPC9.66
1X10: FPC7.10 FPC9.67
1X11: FPC7.11 FPC9.68
1X12: FPC7.12 FPC9.69
1X13: FPC7.13 FPC9.70
1X14: FPC7.14 FPC9.71
1X15: FPC7.15 FPC9.72
1X16: FPC7.16 FPC9.73
1Y1: FPC8.1 FPC9.39
1Y2: FPC8.2 FPC9.40
1Y3: FPC8.3 FPC9.41
1Y4: FPC8.4 FPC9.42
1Y5: FPC8.5 FPC9.43
1Y6: FPC8.6 FPC9.44
1Y7: FPC8.7 FPC9.45
1Y8: FPC8.8 FPC9.46
1Y9: FPC8.9 FPC9.47
1Y10: FPC8.10 FPC9.48
1Y11: FPC8.11 FPC9.49
1Y12: FPC8.12 FPC9.50
1Y13: FPC8.13 FPC9.51
1Y14: FPC8.14 FPC9.52
1Y15: FPC8.15 FPC9.53
1Y16: FPC8.16 FPC9.54
2X1: FPC300.1 U300.47(X0)
2X2: FPC300.2 U300.46(X1)
2X3: FPC300.3 U300.45(X2)
2X4: FPC300.4 U300.44(X3)
2X5: FPC300.5 U300.43(X4)
2X6: FPC300.6 U300.42(X5)
2X7: FPC300.7 U300.41(X6)
2X8: FPC300.8 U300.40(X7)
2X9: FPC300.9 U300.39(X8)
2X10: FPC300.10 U300.36(X9)
2X11: FPC300.11 U300.35(X10)
2X12: FPC300.12 U300.34(X11)
2X13: FPC300.13 U300.33(X12)
2X14: FPC300.14 U300.32(X13)
2X15: FPC300.15 U300.31(X14)
2X16: FPC300.16 U300.30(X15)
2Y1: FPC301.16 U300.53(Y0)
2Y2: FPC301.15 U300.54(Y1)
2Y3: FPC301.14 U300.55(Y2)
2Y4: FPC301.13 U300.56(Y3)
2Y5: FPC301.12 U300.57(Y4)
2Y6: FPC301.11 U300.58(Y5)
2Y7: FPC301.10 U300.59(Y6)
2Y8: FPC301.9 U300.60(Y7)
2Y9: FPC301.8 U300.61(Y8)
2Y10: FPC301.7 U300.62(Y9)
2Y11: FPC301.6 U300.63(Y10)
2Y12: FPC301.5 U300.64(Y11)
2Y13: FPC301.4 U300.65(Y12)
2Y14: FPC301.3 U300.66(Y13)
2Y15: FPC301.2 U300.67(Y14)
2Y16: FPC301.1 U300.68(Y15)
#RESET: C308.2 R304.1 RST3.1 U300.6(~REST~)
BOOT0: R400.2 U400.44(BOOT0)
CHG: CHG5.1 U300.14(ADDSEL/CHG)
COMMSEL: SEL5.1 U300.15(COMMSEL)
D+: R402.1 R405.2 USB400.A6(DP1) USB400.B6(DP2)
D-: R406.2 USB400.A7(DN1) USB400.B7(DN2)
DBG_CLK: SCLK5.1 U300.16(DBG_CLK/GPIO0)
DBG_DATA: SDATA5.1 U300.17(DBG_DATA/GPIO1)
DBG_SS: DSS5.1 U300.18(~DBG_SS~/GPIO2)
DS0: FPC1.2 FPC1.24 FPC1.26 FPC1.34 FPC1.55 FPC1.57 FPC1.79
DS1: FPC9.2 FPC9.24 FPC9.26 FPC9.55
DS2: FPC9.34
DS5: FPC9.57
DS6: FPC9.79
ESD_RING: FPC1.1 FPC1.25 FPC1.56 FPC1.80 FPC1.81 FPC1.82
ESD_RING1: FPC7.17 FPC7.18 FPC8.17 FPC8.18 FPC9.1 FPC9.25 FPC9.56 FPC9.80 FPC9.81 FPC9.82
FSYNC: FSY5.1 U300.19(FSYNC/GPIO3)
GPIO5: IO5.1 U300.22(GPIO5)
LED: U400.2(PC13-TAMPER-RTC)
MCLR: C407.2 U401.39(MCLR/VPP)
MISO: MISO5.1 R302.1 U300.9(CHG/MISO)
MOSI: MOSI5.1 R301.1 U300.8(SDA/MOSI)
NRST: R403.1 U400.7(NRST)
OSC_IN: C412.1 U400.5(PD0-OSC_IN) X400.1
OSC_OUT: C413.2 U400.6(PD1-OSC_OUT) X400.3
PSYNC: PSY5.1 U300.20(PSYNC/GPIO4)
RDY: R404.2 RDY4.1 U400.17(PA7) U401.51(RDY)
RX0: FPC401.16 U401.7(RX13/TX13)
RX1: FPC401.15 U401.8(RX1/TX1)
RX2: FPC401.14 U401.9(RX14/TX14)
RX3: FPC401.13 U401.11(RX2/TX2)
RX4: FPC401.12 U401.12(RX15/TX15)
RX5: FPC401.11 U401.14(RX3/TX3)
RX6: FPC401.10 U401.15(RX16/TX16)
RX7: FPC401.9 U401.16(RX4/TX4)
RX8: FPC401.8 U401.17(RX17/TX17)
RX9: FPC401.7 U401.19(RX5/TX5)
RX10: FPC401.6 U401.20(RX18/TX18)
RX11: FPC401.5 U401.21(RX6/TX6)
RX12: FPC401.4 U401.22(RX19/TX19)
RX13: FPC401.3 U401.24(RX7/TX7)
RX14: FPC401.2 U401.25(RX20/TX20)
RX15: FPC401.1 U401.26(RX8/TX8)
SCK: R300.1 SCK5.1 U300.7(SCL/SCK)
SCL: R408.2 SCL4.1 U400.42(PB6) U401.1(SCL)
SDA: R407.2 SDA4.1 U400.43(PB7) U401.2(SDA)
SHIELD: SHED3.1 U300.96(DS0)
SS: SS3.1 U300.10(~SS~)
SW: U400.46(PB9)
SW_IN: R409.1 SN4.1 U400.18(PB0) U401.52(TX45/SW_IN)
SWCLK: H400.3 U400.37(PA14)
SWDIO: H400.2 U400.34(PA13)
TX0: FPC400.1 U401.50(TX43)
TX1: FPC400.2 U401.49(TX42)
TX2: FPC400.3 U401.48(TX41)
TX3: FPC400.4 U401.47(TX40)
TX4: FPC400.5 U401.46(TX39)
TX5: FPC400.6 U401.45(TX38)
TX6: FPC400.7 U401.44(TX37)
TX7: FPC400.8 U401.43(TX36)
TX8: FPC400.9 U401.42(TX35)
TX9: FPC400.10 U401.41(TX34)
TX10: FPC400.11 U401.40(TX33)
TX11: FPC400.12 U401.38(TX32)
TX12: FPC400.13 U401.37(RX25/TX25)
TX13: FPC400.14 U401.36(RX12/TX12)
TX14: FPC400.15 U401.35(RX24/TX24)
TX15: FPC400.16 U401.34(RX11/TX11)
USB_EN: R401.2 U400.38(PA15)
VREG: C403.1 U401.5(VREG)
X1: C1.1 C17.1 C33.1 C49.1 C65.1 C81.1 C97.1 C113.1 C129.1 C145.1 C161.1 C177.1 C193.1 C209.1 C225.1 C241.1 FPC1.58
X2: C2.1 C18.1 C34.1 C50.1 C66.1 C82.1 C98.1 C114.1 C130.1 C146.1 C162.1 C178.1 C194.1 C210.1 C226.1 C242.1 FPC1.59
X3: C3.1 C19.1 C35.1 C51.1 C67.1 C83.1 C99.1 C115.1 C131.1 C147.1 C163.1 C179.1 C195.1 C211.1 C227.1 C243.1 FPC1.60
X4: C4.1 C20.1 C36.1 C52.1 C68.1 C84.1 C100.1 C116.1 C132.1 C148.1 C164.1 C180.1 C196.1 C212.1 C228.1 C244.1 FPC1.61
X5: C5.1 C21.1 C37.1 C53.1 C69.1 C85.1 C101.1 C117.1 C133.1 C149.1 C165.1 C181.1 C197.1 C213.1 C229.1 C245.1 FPC1.62
X6: C6.1 C22.1 C38.1 C54.1 C70.1 C86.1 C102.1 C118.1 C134.1 C150.1 C166.1 C182.1 C198.1 C214.1 C230.1 C246.1 FPC1.63
X7: C7.1 C23.1 C39.1 C55.1 C71.1 C87.1 C103.1 C119.1 C135.1 C151.1 C167.1 C183.1 C199.1 C215.1 C231.1 C247.1 FPC1.64
X8: C8.1 C24.1 C40.1 C56.1 C72.1 C88.1 C104.1 C120.1 C136.1 C152.1 C168.1 C184.1 C200.1 C216.1 C232.1 C248.1 FPC1.65
X9: C9.1 C25.1 C41.1 C57.1 C73.1 C89.1 C105.1 C121.1 C137.1 C153.1 C169.1 C185.1 C201.1 C217.1 C233.1 C249.1 FPC1.66
X10: C10.1 C26.1 C42.1 C58.1 C74.1 C90.1 C106.1 C122.1 C138.1 C154.1 C170.1 C186.1 C202.1 C218.1 C234.1 C250.1 FPC1.67
X11: C11.1 C27.1 C43.1 C59.1 C75.1 C91.1 C107.1 C123.1 C139.1 C155.1 C171.1 C187.1 C203.1 C219.1 C235.1 C251.1 FPC1.68
X12: C12.1 C28.1 C44.1 C60.1 C76.1 C92.1 C108.1 C124.1 C140.1 C156.1 C172.1 C188.1 C204.1 C220.1 C236.1 C252.1 FPC1.69
X13: C13.1 C29.1 C45.1 C61.1 C77.1 C93.1 C109.1 C125.1 C141.1 C157.1 C173.1 C189.1 C205.1 C221.1 C237.1 C253.1 FPC1.70
X14: C14.1 C30.1 C46.1 C62.1 C78.1 C94.1 C110.1 C126.1 C142.1 C158.1 C174.1 C190.1 C206.1 C222.1 C238.1 C254.1 FPC1.71
X15: C15.1 C31.1 C47.1 C63.1 C79.1 C95.1 C111.1 C127.1 C143.1 C159.1 C175.1 C191.1 C207.1 C223.1 C239.1 C255.1 FPC1.72
X16: C16.1 C32.1 C48.1 C64.1 C80.1 C96.1 C112.1 C128.1 C144.1 C160.1 C176.1 C192.1 C208.1 C224.1 C240.1 C256.1 FPC1.73
Y1: C241.2 C242.2 C243.2 C244.2 C245.2 C246.2 C247.2 C248.2 C249.2 C250.2 C251.2 C252.2 C253.2 C254.2 C255.2 C256.2 FPC1.39
Y2: C225.2 C226.2 C227.2 C228.2 C229.2 C230.2 C231.2 C232.2 C233.2 C234.2 C235.2 C236.2 C237.2 C238.2 C239.2 C240.2 FPC1.40
Y3: C209.2 C210.2 C211.2 C212.2 C213.2 C214.2 C215.2 C216.2 C217.2 C218.2 C219.2 C220.2 C221.2 C222.2 C223.2 C224.2 FPC1.41
Y4: C193.2 C194.2 C195.2 C196.2 C197.2 C198.2 C199.2 C200.2 C201.2 C202.2 C203.2 C204.2 C205.2 C206.2 C207.2 C208.2 FPC1.42
Y5: C177.2 C178.2 C179.2 C180.2 C181.2 C182.2 C183.2 C184.2 C185.2 C186.2 C187.2 C188.2 C189.2 C190.2 C191.2 C192.2 FPC1.43
Y6: C161.2 C162.2 C163.2 C164.2 C165.2 C166.2 C167.2 C168.2 C169.2 C170.2 C171.2 C172.2 C173.2 C174.2 C175.2 C176.2 FPC1.44
Y7: C145.2 C146.2 C147.2 C148.2 C149.2 C150.2 C151.2 C152.2 C153.2 C154.2 C155.2 C156.2 C157.2 C158.2 C159.2 C160.2 FPC1.45
Y8: C129.2 C130.2 C131.2 C132.2 C133.2 C134.2 C135.2 C136.2 C137.2 C138.2 C139.2 C140.2 C141.2 C142.2 C143.2 C144.2 FPC1.46
Y9: C113.2 C114.2 C115.2 C116.2 C117.2 C118.2 C119.2 C120.2 C121.2 C122.2 C123.2 C124.2 C125.2 C126.2 C127.2 C128.2 FPC1.47
Y10: C97.2 C98.2 C99.2 C100.2 C101.2 C102.2 C103.2 C104.2 C105.2 C106.2 C107.2 C108.2 C109.2 C110.2 C111.2 C112.2 FPC1.48
Y11: C81.2 C82.2 C83.2 C84.2 C85.2 C86.2 C87.2 C88.2 C89.2 C90.2 C91.2 C92.2 C93.2 C94.2 C95.2 C96.2 FPC1.49
Y12: C65.2 C66.2 C67.2 C68.2 C69.2 C70.2 C71.2 C72.2 C73.2 C74.2 C75.2 C76.2 C77.2 C78.2 C79.2 C80.2 FPC1.50
Y13: C49.2 C50.2 C51.2 C52.2 C53.2 C54.2 C55.2 C56.2 C57.2 C58.2 C59.2 C60.2 C61.2 C62.2 C63.2 C64.2 FPC1.51
Y14: C33.2 C34.2 C35.2 C36.2 C37.2 C38.2 C39.2 C40.2 C41.2 C42.2 C43.2 C44.2 C45.2 C46.2 C47.2 C48.2 FPC1.52
Y15: C17.2 C18.2 C19.2 C20.2 C21.2 C22.2 C23.2 C24.2 C25.2 C26.2 C27.2 C28.2 C29.2 C30.2 C31.2 C32.2 FPC1.53
Y16: C1.2 C2.2 C3.2 C4.2 C5.2 C6.2 C7.2 C8.2 C9.2 C10.2 C11.2 C12.2 C13.2 C14.2 C15.2 C16.2 FPC1.54
$1N85: C406.1 U401.27(RX21/TX21)
$1N86: C406.2 U401.28(TX30)
$1N155: R411.1 USB400.A5(CC1)
$1N157: R410.1 USB400.B5(CC2)
$1N196: Q400.1(B) R401.1
$1N198: Q400.3(C) R402.2
$1N212: R405.1 U400.33(PA12)
$1N224: R406.1 U400.32(PA11)
$1N751: C309.1 U300.4(EXTCAP1)
$1N752: C305.1 U300.72(Y19)
$1N753: C305.2 U300.79(X17)
$1N755: R303.1 U300.21(~TEST~)
$1N766: C309.2 U300.3(EXTCAP0)
Net-(AVDD5-1): AVDD5.1 C312.2 C315.2 U300.52(AVDD) U300.73(AVDD)
Net-(C301-2): C301.2 C303.2 U300.12(VDDCORE) VDDCODE5.1
Net-(C302-2): C302.2 C304.2 U300.2(VDDIO) U300.23(VDDIO) VDDIO5.1
Net-(C307-2): C307.2 U300.11(VDD) VDD3.1
Net-(C313-2): C313.2 C314.2 U300.38(XVDD) U300.87(XVDD) XVDD3.1

Not connected (* = marked no-connect by the designer): C300 1 2; C306 1 2; C310 1 2; C311 1 2; C400 2; C401 1 2; C402 1 2; C403 2; C404 1 2; C405 1 2; C407 1; FPC1 3 4 5 6 7 8 9 10 11 12 13 14 15 16 17 18 19 20 21 22 23 27 28 29 30 31 32 33 35 36 37 38 74 75 76 77 78; FPC9 3 4 5 6 7 8 9 10 11 12 13 14 15 16 17 18 19 20 21 22 23 27 28 29 30 31 32 33 35 36 37 38 74 75 76 77 78; FPC400 17 18; FPC401 17 18; U300 1(NC)* 5(GND)* 25(NC)* 26(NC)* 27(NC)* 28(NC)* 29(X16)* 48(NC)* 49(NC)* 50(NC)* 69(Y16)* 70(Y17)* 71(Y18)* 75(NC)* 76(NC)* 77(NC)* 78(NC)* 80(X18)* 81(X19)* 82(X20)* 83(X21)* 84(X22)* 85(X23)* 86(X24)* 89(X25)* 90(X26)* 91(X27)* 92(X28)* 93(X29)* 94(X30)* 95(X31)* 97(NC)* 98(NC)* 99(NC)* 100(NC)*; U400 1(VBAT) 3(PC14-OSC32_IN) 4(PC15-OSC32_OUT) 10(PA0-WKUP) 11(PA1) 12(PA2) 13(PA3) 14(PA4) 15(PA5) 16(PA6) 19(PB1) 20(PB2) 21(PB10) 22(PB11) 25(PB12) 26(PB13) 27(PB14) 28(PB15) 29(PA8) 30(PA9) 31(PA10) 39(PB3) 40(PB4) 41(PB5) 45(PB8); U401 6(RX0/TX0) 10(TX26) 13(TX27) 18(TX28) 23(TX29) 29(RX9/TX9) 30(RX22/TX22) 31(RX10/TX10) 32(RX23/TX23) 33(TX31); U402 4(NC); USB400 A8(SBU1) B8(SBU2)

## Notes on the sheet
- 驱动屏蔽
- STM32F103C8T6
- 复位
- I²C地址选择
- SPI
- 同步信号
- 晶振
- SWD
- 行FPC
- 列FPC
- 3V
- USB TYPE-C
- 列FPC
- 行FPC
